# Altium schematic sheet CPLD.SchDoc
size A4; DocumentNumber: 1; SheetNumber: 2; SheetTotal: 7
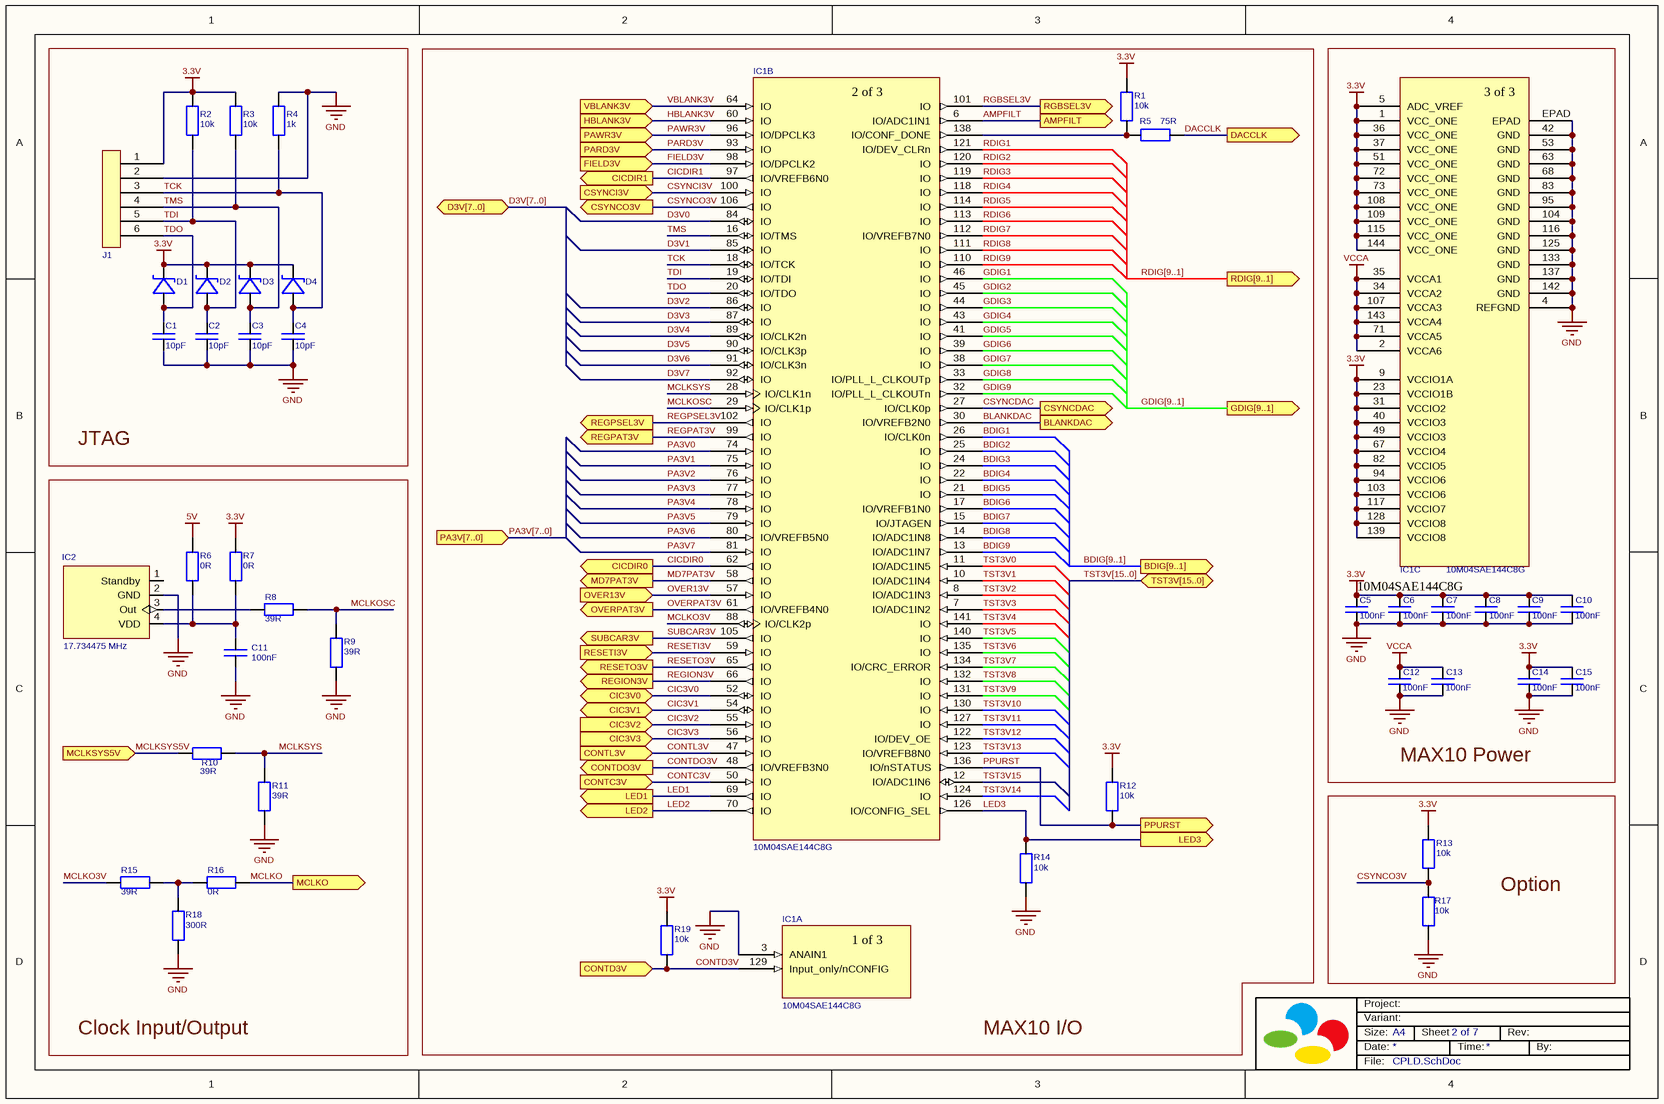
[diagram p0: CPLD.SchDoc]

## Parts
C1  value 10pF  [Cap_0402_Chip]  (hidden comment: Ceramic Capacitor 10pF 10V ±20% X7R 0402)
C2  value 10pF  [Cap_0402_Chip]  (hidden comment: Ceramic Capacitor 10pF 10V ±20% X7R 0402)
C3  value 10pF  [Cap_0402_Chip]  (hidden comment: Ceramic Capacitor 10pF 10V ±20% X7R 0402)
C4  value 10pF  [Cap_0402_Chip]  (hidden comment: Ceramic Capacitor 10pF 10V ±20% X7R 0402)
C5  value 100nF  [Cap_0402_Chip]  (hidden comment: Ceramic Capacitor 100nF 10V ±20% X7R 0402)
C6  value 100nF  [Cap_0402_Chip]  (hidden comment: Ceramic Capacitor 100nF 10V ±20% X7R 0402)
C7  value 100nF  [Cap_0402_Chip]  (hidden comment: Ceramic Capacitor 100nF 10V ±20% X7R 0402)
C8  value 100nF  [Cap_0402_Chip]  (hidden comment: Ceramic Capacitor 100nF 10V ±20% X7R 0402)
C9  value 100nF  [Cap_0402_Chip]  (hidden comment: Ceramic Capacitor 100nF 10V ±20% X7R 0402)
C10  value 100nF  [Cap_0402_Chip]  (hidden comment: Ceramic Capacitor 100nF 10V ±20% X7R 0402)
C11  value 100nF  [Cap_0402_Chip]  (hidden comment: Ceramic Capacitor 100nF 10V ±20% X7R 0402)
C12  value 100nF  [Cap_0402_Chip]  (hidden comment: Ceramic Capacitor 100nF 10V ±20% X7R 0402)
C13  value 100nF  [Cap_0402_Chip]  (hidden comment: Ceramic Capacitor 100nF 10V ±20% X7R 0402)
C14  value 100nF  [Cap_0402_Chip]  (hidden comment: Ceramic Capacitor 100nF 10V ±20% X7R 0402)
C15  value 100nF  [Cap_0402_Chip]  (hidden comment: Ceramic Capacitor 100nF 10V ±20% X7R 0402)
D1  BAT54WS  [SOD323]  (value not drawn)
D2  BAT54WS  [SOD323]  (value not drawn)
D3  BAT54WS  [SOD323]  (value not drawn)
D4  BAT54WS  [SOD323]  (value not drawn)
IC1  10M04SAE144C8G  [EQFP-144_A:1P65_]  (parts A,B,C of 3)
IC2  17.734475 MHz  [Quarz 7.5mm]
J1  Conn 6P  [Con6P]  (value not drawn)  (no BOM)
R1  value 10k  [Res_0402_Chip]  (hidden comment: Resistor 10k 0402 ±1%)
R2  value 10k  [Res_0402_Chip]  (hidden comment: Resistor 10k 0402 ±1%)
R3  value 10k  [Res_0402_Chip]  (hidden comment: Resistor 10k 0402 ±1%)
R4  value 1k  [Res_0402_Chip]  (hidden comment: Resistor 1k 0402 ±1%)
R5  value 75R  [Res_0402_Chip]  (hidden comment: Resistor 75R 0402 ±1%)
R6  value 0R  [Res_0402_Chip]  (hidden comment: Resistor 0R 0402)
R7  value 0R  [Res_0402_Chip]  (hidden comment: Resistor 0R 0402)
R8  value 39R  [Res_0603_Chip]  (hidden comment: Resistor 39R 0603 ±1%)
R9  value 39R  [Res_0603_Chip]  (hidden comment: Resistor 39R 0603 ±1%)
R10  value 39R  [Res_0603_Chip]  (hidden comment: Resistor 39R 0603 ±1%)
R11  value 39R  [Res_0603_Chip]  (hidden comment: Resistor 39R 0603 ±1%)
R12  value 10k  [Res_0402_Chip]  (hidden comment: Resistor 10k 0402 ±1%)
R13  value 10k  [Res_0402_Chip]  (hidden comment: Resistor 10k 0402 ±1%)
R14  value 10k  [Res_0402_Chip]  (hidden comment: Resistor 10k 0402 ±1%)
R15  value 39R  [Res_0603_Chip]  (hidden comment: Resistor 39R 0603 ±1%)
R16  value 0R  [Res_0603_Chip]  (hidden comment: Resistor 0R 0603)
R17  value 10k  [Res_0402_Chip]  (hidden comment: Resistor 10k 0402 ±1%)
R18  value 300R  [Res_0603_Chip]  (hidden comment: Resistor 300R 0603 ±1%)
R19  value 10k  [Res_0402_Chip]  (hidden comment: Resistor 10k 0402 ±1%)

## Blocks framed on the sheet
JTAG: C1-C4 D1-D4 J1 R2-R4
MAX10 I/O: IC1 R1 R5 R12 R14 R19
MAX10 Power: C5-C10 C12-C15 IC1
Clock Input/Output: C11 IC2 R6-R11 R15 R16 R18
Option: R13 R17

## Ports
AMPFILT (out), BDIG[9..1] (out), BLANKDAC (out), CIC3V0 (bidir), CIC3V1 (bidir), CIC3V2 (in), CIC3V3 (in), CICDIR0 (out), CICDIR1 (out), CONTC3V (in), CONTD3V (in), CONTDO3V (out), CONTL3V (in), CSYNCDAC (out), CSYNCI3V (in), CSYNCO3V (out), D3V[7..0] (bidir), DACCLK (out), FIELD3V (in), GDIG[9..1] (out), HBLANK3V (in), LED1 (out), LED2 (out), LED3 (out), MCLKO (out), MCLKSYS5V (in), MD7PAT3V (out), OVER13V (in), OVERPAT3V (out), PA3V[7..0] (in), PARD3V (in), PAWR3V (in), PPURST (out), RDIG[9..1] (out), REGION3V (out), REGPAT3V (out), REGPSEL3V (out), RESETI3V (in), RESETO3V (out), RGBSEL3V (out), SUBCAR3V (out), TST3V[15..0] (bidir), VBLANK3V (in)

## Nets
3.3V: C5.1 C6.1 C7.1 C8.1 C9.1 C10.1 C14.1 C15.1 D1.1(K) D2.1(K) D3.1(K) D4.1(K) IC1.1(VCC_ONE) IC1.5(ADC_VREF) IC1.9(VCCIO1A) IC1.23(VCCIO1B) IC1.31(VCCIO2) IC1.36(VCC_ONE) IC1.37(VCC_ONE) IC1.40(VCCIO3) IC1.49(VCCIO3) IC1.51(VCC_ONE) IC1.67(VCCIO4) IC1.72(VCC_ONE) IC1.73(VCC_ONE) IC1.82(VCCIO5) IC1.94(VCCIO6) IC1.103(VCCIO6) IC1.108(VCC_ONE) IC1.109(VCC_ONE) IC1.115(VCC_ONE) IC1.117(VCCIO7) IC1.128(VCCIO8) IC1.139(VCCIO8) IC1.144(VCC_ONE) J1.1 R1.1 R2.1 R3.1 R7.1 R12.1 R13.1 R19.1
5V: R6.1
GND: C1.2 C2.2 C3.2 C4.2 C5.2 C6.2 C7.2 C8.2 C9.2 C10.2 C11.2 C12.2 C13.2 C14.2 C15.2 IC1.3(ANAIN1) IC1.4(REFGND) IC1.42(GND) IC1.53(GND) IC1.63(GND) IC1.68(GND) IC1.83(GND) IC1.95(GND) IC1.104(GND) IC1.116(GND) IC1.125(GND) IC1.133(GND) IC1.137(GND) IC1.142(GND) IC1.EPAD IC2.2(GND) J1.2 R4.2 R9.2 R11.2 R14.1 R17.2 R18.2
VCCA: C12.1 C13.1 IC1.2(VCCA6) IC1.34(VCCA2) IC1.35(VCCA1) IC1.71(VCCA5) IC1.107(VCCA3) IC1.143(VCCA4)
AMPFILT: IC1.6(IO/ADC1IN1) ; port AMPFILT
BDIG1: IC1.26(IO/CLK0n)
BDIG2: IC1.25(IO)
BDIG3: IC1.24(IO)
BDIG4: IC1.22(IO)
BDIG5: IC1.21(IO)
BDIG6: IC1.17(IO/VREFB1N0)
BDIG7: IC1.15(IO/JTAGEN)
BDIG8: IC1.14(IO/ADC1IN8)
BDIG9: IC1.13(IO/ADC1IN7)
BLANKDAC: IC1.30(IO/VREFB2N0) ; port BLANKDAC
CIC3V0: IC1.52(IO) ; port CIC3V0
CIC3V1: IC1.54(IO) ; port CIC3V1
CIC3V2: IC1.55(IO) ; port CIC3V2
CIC3V3: IC1.56(IO) ; port CIC3V3
CICDIR0: IC1.62(IO) ; port CICDIR0
CICDIR1: IC1.97(IO/VREFB6N0) ; port CICDIR1
CONTC3V: IC1.50(IO) ; port CONTC3V
CONTD3V: IC1.129(Input_only/nCONFIG) R19.2 ; port CONTD3V
CONTDO3V: IC1.48(IO/VREFB3N0) ; port CONTDO3V
CONTL3V: IC1.47(IO) ; port CONTL3V
CSYNCDAC: IC1.27(IO/CLK0p) ; port CSYNCDAC
CSYNCI3V: IC1.100(IO) ; port CSYNCI3V
CSYNCO3V: IC1.106(IO) R13.2 R17.1 ; port CSYNCO3V
D3V0: IC1.84(IO)
D3V1: IC1.85(IO)
D3V2: IC1.86(IO)
D3V3: IC1.87(IO)
D3V4: IC1.89(IO/CLK2n)
D3V5: IC1.90(IO/CLK3p)
D3V6: IC1.91(IO/CLK3n)
D3V7: IC1.92(IO)
DACCLK: R5.2 ; port DACCLK
FIELD3V: IC1.98(IO/DPCLK2) ; port FIELD3V
GDIG1: IC1.46(IO)
GDIG2: IC1.45(IO)
GDIG3: IC1.44(IO)
GDIG4: IC1.43(IO)
GDIG5: IC1.41(IO)
GDIG6: IC1.39(IO)
GDIG7: IC1.38(IO)
GDIG8: IC1.33(IO/PLL_L_CLKOUTp)
GDIG9: IC1.32(IO/PLL_L_CLKOUTn)
HBLANK3V: IC1.60(IO) ; port HBLANK3V
LED1: IC1.69(IO) ; port LED1
LED2: IC1.70(IO) ; port LED2
LED3: IC1.126(IO/CONFIG_SEL) R14.2 ; port LED3
MCLKO: R16.1 ; port MCLKO
MCLKO3V: IC1.88(IO/CLK2p) R15.2
MCLKOSC: IC1.29(IO/CLK1p) R8.1 R9.1
MCLKSYS: IC1.28(IO/CLK1n) R10.1 R11.1
MCLKSYS5V: R10.2 ; port MCLKSYS5V
MD7PAT3V: IC1.58(IO) ; port MD7PAT3V
OVER13V: IC1.57(IO) ; port OVER13V
OVERPAT3V: IC1.61(IO/VREFB4N0) ; port OVERPAT3V
PA3V0: IC1.74(IO)
PA3V1: IC1.75(IO)
PA3V2: IC1.76(IO)
PA3V3: IC1.77(IO)
PA3V4: IC1.78(IO)
PA3V5: IC1.79(IO)
PA3V6: IC1.80(IO/VREFB5N0)
PA3V7: IC1.81(IO)
PARD3V: IC1.93(IO) ; port PARD3V
PAWR3V: IC1.96(IO/DPCLK3) ; port PAWR3V
PPURST: IC1.136(IO/nSTATUS) R12.2 ; port PPURST
RDIG1: IC1.121(IO/DEV_CLRn)
RDIG2: IC1.120(IO)
RDIG3: IC1.119(IO)
RDIG4: IC1.118(IO)
RDIG5: IC1.114(IO)
RDIG6: IC1.113(IO)
RDIG7: IC1.112(IO/VREFB7N0)
RDIG8: IC1.111(IO)
RDIG9: IC1.110(IO)
REGION3V: IC1.66(IO) ; port REGION3V
REGPAT3V: IC1.99(IO) ; port REGPAT3V
REGPSEL3V: IC1.102(IO) ; port REGPSEL3V
RESETI3V: IC1.59(IO) ; port RESETI3V
RESETO3V: IC1.65(IO) ; port RESETO3V
RGBSEL3V: IC1.101(IO) ; port RGBSEL3V
SUBCAR3V: IC1.105(IO) ; port SUBCAR3V
TCK: C4.1 D4.2(A) IC1.18(IO/TCK) J1.3 R4.1
TDI: C2.1 D2.2(A) IC1.19(IO/TDI) J1.5 R2.2
TDO: C1.1 D1.2(A) IC1.20(IO/TDO) J1.6
TMS: C3.1 D3.2(A) IC1.16(IO/TMS) J1.4 R3.2
TST3V0: IC1.11(IO/ADC1IN5)
TST3V1: IC1.10(IO/ADC1IN4)
TST3V2: IC1.8(IO/ADC1IN3)
TST3V3: IC1.7(IO/ADC1IN2)
TST3V4: IC1.141(IO)
TST3V5: IC1.140(IO)
TST3V6: IC1.135(IO)
TST3V7: IC1.134(IO/CRC_ERROR)
TST3V8: IC1.132(IO)
TST3V9: IC1.131(IO)
TST3V10: IC1.130(IO)
TST3V11: IC1.127(IO)
TST3V12: IC1.122(IO/DEV_OE)
TST3V13: IC1.123(IO/VREFB8N0)
TST3V14: IC1.124(IO)
TST3V15: IC1.12(IO/ADC1IN6)
VBLANK3V: IC1.64(IO) ; port VBLANK3V
NetC11_1: C11.1 IC2.4(VDD) R6.2 R7.2
NetIC1_138: IC1.138(IO/CONF_DONE) R1.2 R5.1
NetIC2_3: IC2.3(Out) R8.2
NetR15_1: R15.1 R16.2 R18.1

Not connected (* = marked no-connect by the designer): IC2 1(Standby)

## Buses and harness runs
bus BDIG[9..1] = port BDIG[9..1]
bus D3V[7..0] = port D3V[7..0]
bus GDIG[9..1] = port GDIG[9..1]
bus PA3V[7..0] = port PA3V[7..0]
bus RDIG[9..1] = port RDIG[9..1]
bus TST3V[15..0] = port TST3V[15..0]

## Notes on the sheet
- Size:
- Date:
- Variant:
- Project:
- A4
- Sheet
- Time:
- Rev:
- By:
- File:
- (in symbol 10M08SAE144C8G, part A) 1 of 3
- (in symbol 10M08SAE144C8G, part B) 2 of 3
- (in symbol 10M08SAE144C8G, part C) 3 of 3

## Library data of the parts
C1-C15 = Capacitor: ChipSize: 0402; NominalVoltage: 10V; Dielectric: X7R; Tolerance: ±20%; PartType: Ceramic Capacitor
D1-D4 = Schottky Diode: Manufacturer_Part_Number: BAT54WS-7-F; Manufacturer: Diodes
IC1 = 10M08SAE144C8G: No Description Available; Manufacturer: Intel; SourceLibrary: Intel_2020-01-10; Built_By: EMA_Cory; Copyright: Copyright (C) 2018 Accelerated Designs. All rights reserved; Manufacturer_Part_Number: 10M04SAE144C8G; RefDes: RefDes; Type: DEV
IC2 = Oscillator: Manufacturer: IQD Frequency; Manufacturer_Part_Number: LFSPXO020648Bulk; Frequency: 17.734475 MHz
J1 = Conn 6P: 6 Pole Connector
R1-R7 R12-R14 R17 R19 = R: ChipSize: 0402; PartType: Resistor
  R1-R5 R12-R14 R17 R19: Tolerance: ±1%
R8-R11 R15 R16 R18 = R: ChipSize: 0603; PartType: Resistor
  R8-R11 R15 R18: Tolerance: ±1%